# EAGLE design childboard_dht22_v1 (EAGLE 7.3.0)
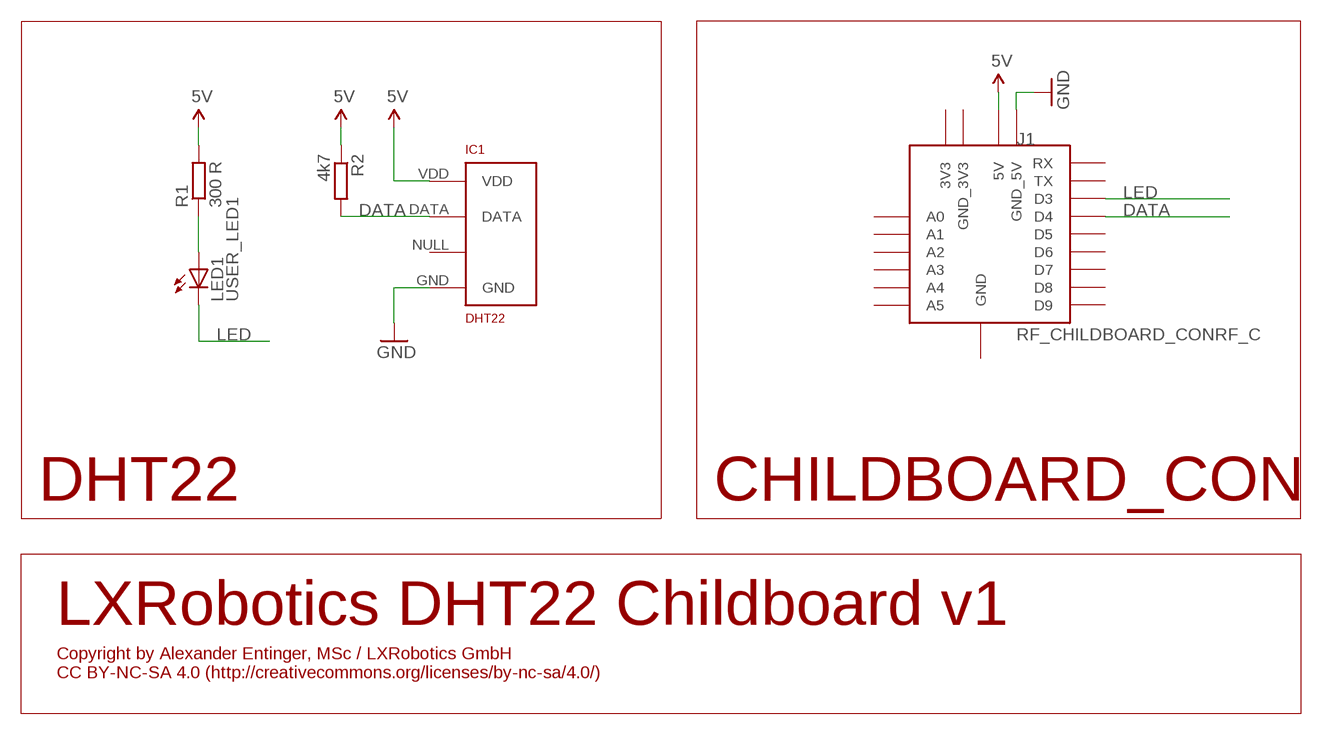
[diagram p0: schematic, sheet 1]

## Parts
IC1  DHT22  RHT03_DHT-22_AM2302RA  [RHT03_DHT-22/RA]
J1  RF_CHILDBOARD_CONRF_C  [RF_CHILDBOARD_CON]
LED1  USER_LED1  LED5MM  [LED5MM]
R1  300 R  R-EU_0204/7  [0204/7]
R2  4k7  R-EU_0204/7  [0204/7]

## Nets
5V: IC1.VDD J1.5V R1.2 R2.1
DATA: IC1.DATA J1.D4 R2.2
GND: IC1.GND J1.GND_5V
LED: J1.D3 LED1.K(C)
N$8: LED1.A R1.1
Unconnected: IC1.NULL J1.3V3 J1.A0 J1.A1 J1.A2 J1.A3 J1.A4 J1.A5 J1.D5 J1.D6 J1.D7 J1.D8 J1.D9 J1.GND_3V3 J1.GND_(GND) J1.RX J1.TX

## Notes on the sheet
- DHT22 | CHILDBOARD_CON
- LXRobotics DHT22 Childboard v1
- Copyright by Alexander Entinger, MSc / LXRobotics GmbH 
  CC BY-NC-SA 4.0 (http://creativecommons.org/licenses/by-nc-sa/4.0/)

## Library data of the parts
IC1 = RHT03_DHT-22_AM2302:RHT03_DHT-22_AM2302: RHT03 / DHT-22 / AM2302 Packages and symbol for the RHT03 / DHT-22 relative humidity and temperature sensor. Note: The AM2302 is a wired version of the DHT-22 which typically requires less clearance and is thus provided as a separate package.; PROD_ID: SEN-10167
J1 = lxrobotics:RF_CHILDBOARD_CON
LED1 = SparkFun-LED:LED: LEDs Standard schematic elements and footprints for 5mm, 3mm, 1206, and 0603 sized LEDs. 5mm - Spark Fun Electronics SKU : COM-00529 (and others)
R1 R2 = resistor:R-EU_: RESISTOR, European symbol

## Board
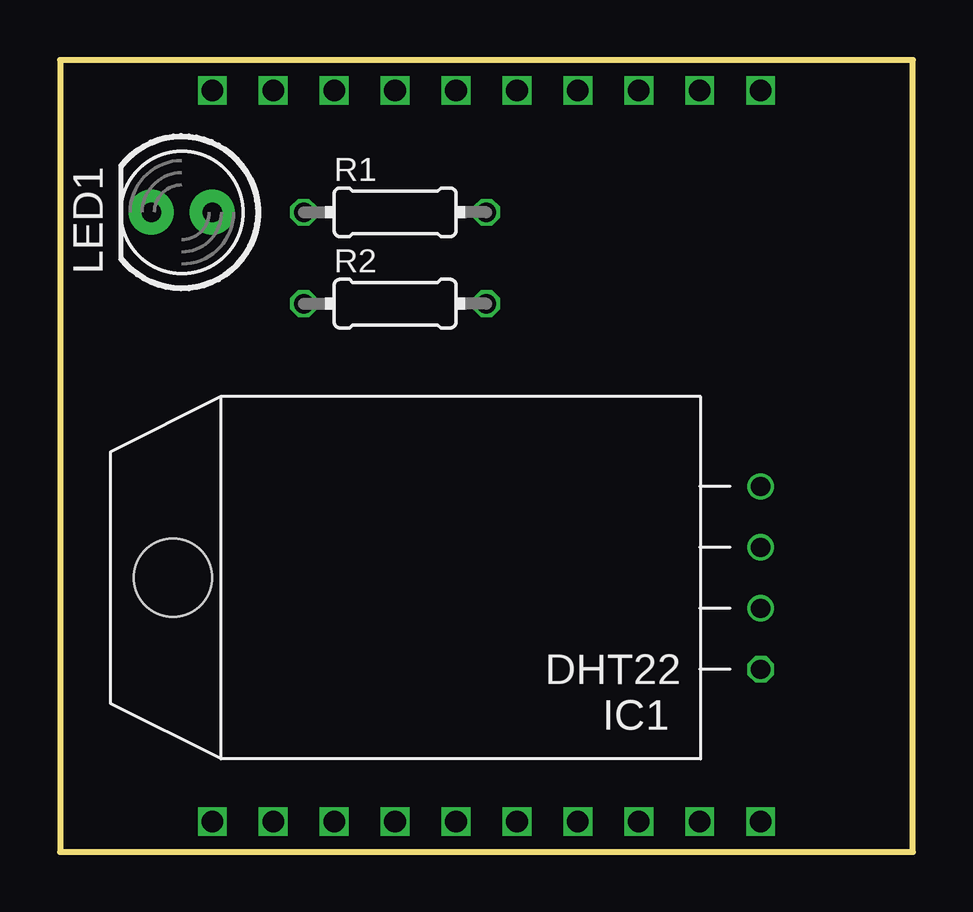
[diagram p1: board, top side]
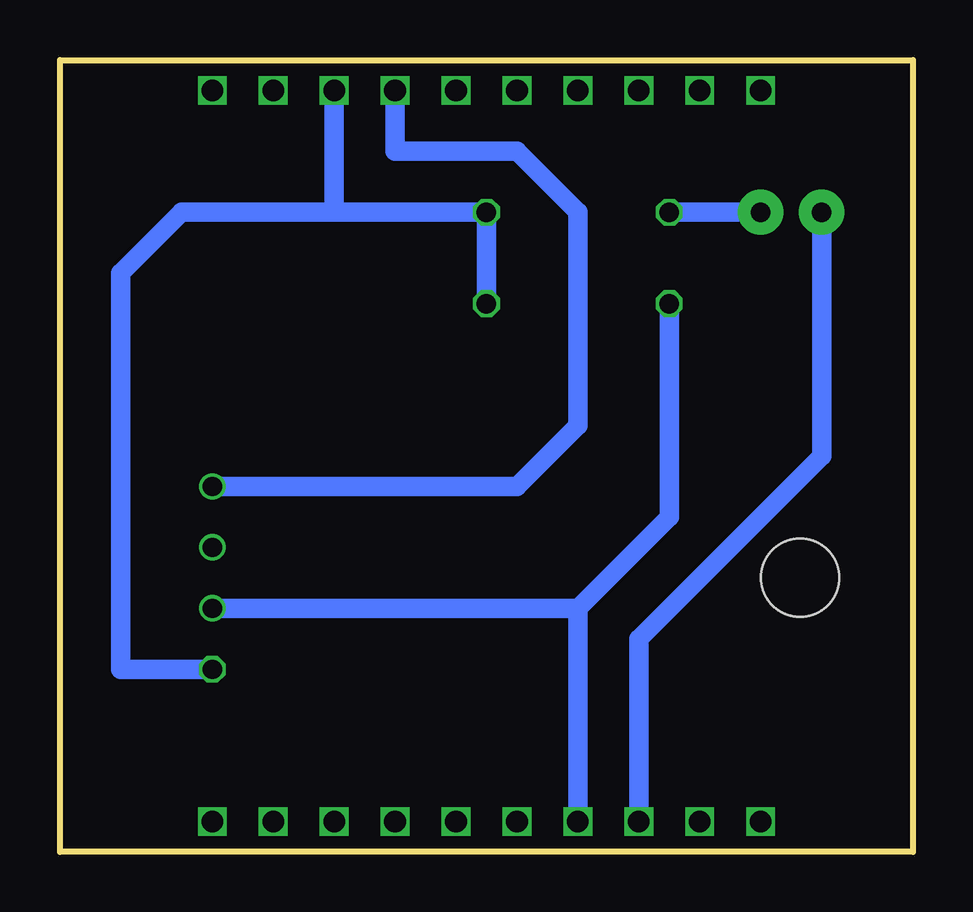
[diagram p2: board, bottom side, seen from below]

Size 35.56 x 33.02 mm. Coordinates in mm from the lower left corner, seen from the top.
Outline: 0,0 35.56,0 35.56,33.02 0,33.02 0,0
Copper layers (1*16): Top 0.035mm / dielectric 1.5mm / Bottom 0.035mm
Design rules "Eagle-DRU - 1506 - LeitOn - 01 and 02 layers - STANDARD": minimum track width 0.15mm, minimum drill 0.3mm, track to track 0.15mm, track to pad 0.15mm, pad to pad 0.15mm, via to via 0.15mm, smd to smd 0.15mm, copper to edge 0.2mm, drill to drill 0.25mm, minimum pad ring 0.15mm, minimum via ring 0.15mm, stop-mask expansion 0.05mm, vias tented up to drill 0mil, thermal gap 0.2mm

### Footprints (pad centres in the part's own frame; a part is rotated, then mirrored left to right if it is on the bottom)
RHT03_DHT-22/RA = drill 0.8: DATA -1.27,0; GND 3.81,0; NULL 1.27,0 | drill 0.8 octagon: VDD -3.81,0 | hole 3.25: 0,24.5
RF_CHILDBOARD_CON = drill 0.9 square: 3V3 12.7,30.48; 5V 7.62,30.48; A0 2.54,30.48; A1 0,30.48; A2 -2.54,30.48; A3 -5.08,30.48; A4 -7.62,30.48; A5 -10.16,30.48; D3 -5.08,0; D4 -2.54,0; D5 0,0; D6 2.54,0; D7 5.08,0; D8 7.62,0; D9 10.16,0; GND_ 12.7,0; GND_3V3 10.16,30.48; GND_5V 5.08,30.48; RX -10.16,0; TX -7.62,0
LED5MM = drill 0.813 pad 1.88: A -1.27,0; K 1.27,0
0204/7 = drill 0.813 octagon: 1 -3.81,0; 2 3.81,0

### Placement (x,y rotation side)
IC1  29.21,11.43 90 top
J1  16.51,1.27 0 top
LED1  5.08,26.67 180 top
R1  13.97,26.67 0 top
R2  13.97,22.86 180 top

### Tracks (layer width: path | path; a pad name or v marks a point on that pad's centre or on a via)
5V
  Bottom 0.813: R2.1 R1.2 24.13,26.67 | 24.13,26.67 J1.5V | IC1.VDD 33.02,7.62 33.02,24.13 30.48,26.67 24.13,26.67
DATA
  Bottom 0.813: IC1.DATA 13.97,10.16 | 13.97,10.16 J1.D4 | R2.2 10.16,13.97 13.97,10.16
GND
  Bottom 0.813: IC1.GND 16.51,15.24 13.97,17.78 13.97,26.67 16.51,29.21 21.59,29.21 J1.GND_5V
LED
  Bottom 0.813: J1.D3 11.43,8.89 3.81,16.51 LED1.K
N$8
  Bottom 0.813: LED1.A R1.1